# Altium schematic sheet Batarey.SchDoc
size A1; SheetNumber: 4; SheetTotal: 5
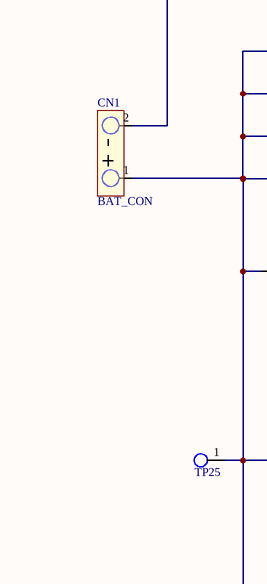
[diagram p0: Batarey.SchDoc, top left]
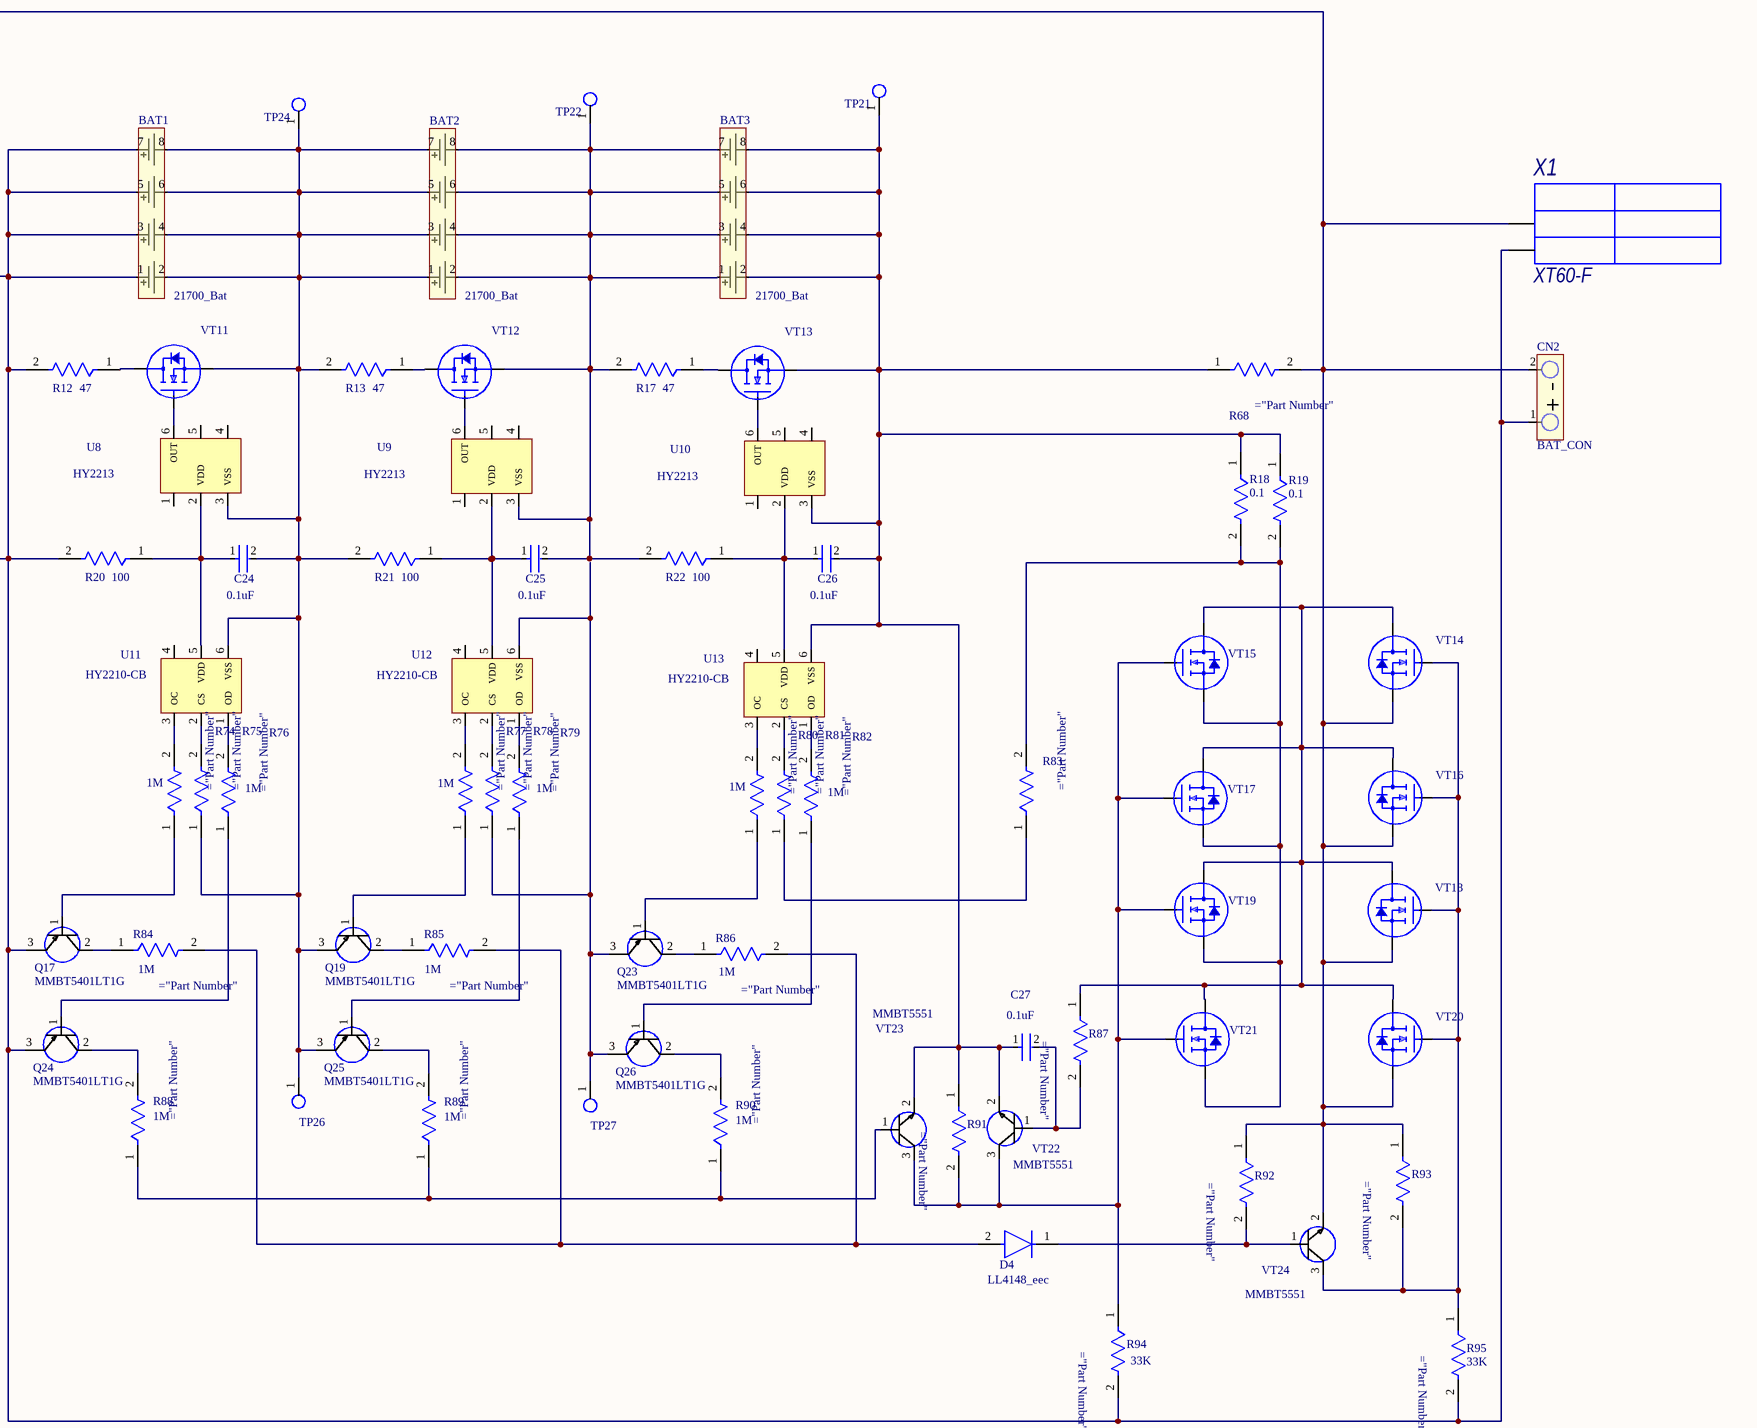
[diagram p1: Batarey.SchDoc, top right]
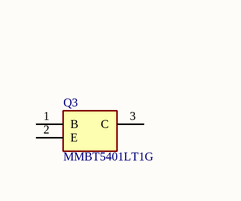
[diagram p2: Batarey.SchDoc, bottom left]

## Parts
BAT1  21700_Bat  [21700_BAT]
BAT2  21700_Bat  [21700_BAT]
BAT3  21700_Bat  [21700_BAT]
C24  0.1uF  [KEMET_C0805C-DN_IPC_A]
C25  0.1uF  [KEMET_C0805C-DN_IPC_A]
C26  0.1uF  [KEMET_C0805C-DN_IPC_A]
C27  0.1uF  [KEMET_C0805C-DN_IPC_A]
CN1  BAT_CON  [Batarey_connector]
CN2  BAT_CON  [Batarey_connector]
D4  LL4148_eec  [Fairchild-ON_Semiconductor_LL4148_0]
Q3  MMBT5401LT1G  [SOT96P237X111-3N]
Q17  MMBT5401LT1G  [SOT96P237X111-3N]
Q19  MMBT5401LT1G  [SOT96P237X111-3N]
Q23  MMBT5401LT1G  [SOT96P237X111-3N]
Q24  MMBT5401LT1G  [SOT96P237X111-3N]
Q25  MMBT5401LT1G  [SOT96P237X111-3N]
Q26  MMBT5401LT1G  [SOT96P237X111-3N]
R12  47  [TE_Connectivity_CRGCQ1210_IPC_A]
R13  47  [TE_Connectivity_CRGCQ1210_IPC_A]
R17  47  [TE_Connectivity_CRGCQ1210_IPC_A]
R18  0.1  [TE_Connectivity_CRGCQ1210_IPC_A]
R19  0.1  [TE_Connectivity_CRGCQ1210_IPC_A]
R20  100  [Vishay_CRCW0805-e3_IPC_A]
R21  100  [Vishay_CRCW0805-e3_IPC_A]
R22  100  [Vishay_CRCW0805-e3_IPC_A]
R68  RC0805FR-07100KL  [Vishay_CRCW0805-e3_IPC_A]  (value not drawn)
R74  1M  [Vishay_CRCW0805-e3_IPC_A]
R75  RC0805FR-07100KL  [Vishay_CRCW0805-e3_IPC_A]  (value not drawn)
R76  1M  [Vishay_CRCW0805-e3_IPC_A]
R77  1M  [Vishay_CRCW0805-e3_IPC_A]
R78  RC0805FR-07100KL  [Vishay_CRCW0805-e3_IPC_A]  (value not drawn)
R79  1M  [Vishay_CRCW0805-e3_IPC_A]
R80  1M  [Vishay_CRCW0805-e3_IPC_A]
R81  RC0805FR-07100KL  [Vishay_CRCW0805-e3_IPC_A]  (value not drawn)
R82  1M  [Vishay_CRCW0805-e3_IPC_A]
R83  RC0805FR-07100KL  [Vishay_CRCW0805-e3_IPC_A]  (value not drawn)
R84  1M  [Vishay_CRCW0805-e3_IPC_A]
R85  1M  [Vishay_CRCW0805-e3_IPC_A]
R86  1M  [Vishay_CRCW0805-e3_IPC_A]
R87  RC0805FR-07100KL  [Vishay_CRCW0805-e3_IPC_A]  (value not drawn)
R88  1M  [Vishay_CRCW0805-e3_IPC_A]
R89  1M  [Vishay_CRCW0805-e3_IPC_A]
R90  1M  [Vishay_CRCW0805-e3_IPC_A]
R91  RC0805FR-07100KL  [Vishay_CRCW0805-e3_IPC_A]  (value not drawn)
R92  RC0805FR-07100KL  [Vishay_CRCW0805-e3_IPC_A]  (value not drawn)
R93  RC0805FR-07100KL  [Vishay_CRCW0805-e3_IPC_A]  (value not drawn)
R94  33K  [Vishay_CRCW0805-e3_IPC_A]
R95  33K  [Vishay_CRCW0805-e3_IPC_A]
TP21  Test_Point_PCB  [TEST_POINT_CONN]  (value not drawn)
TP22  Test_Point_PCB  [TEST_POINT_CONN]  (value not drawn)
TP24  Test_Point_PCB  [TEST_POINT_CONN]  (value not drawn)
TP25  Test_Point_PCB  [TEST_POINT_CONN]  (value not drawn)
TP26  Test_Point_PCB  [TEST_POINT_CONN]  (value not drawn)
TP27  Test_Point_PCB  [TEST_POINT_CONN]  (value not drawn)
U8  HY2213  [HY2213]
U9  HY2213  [HY2213]
U10  HY2213  [HY2213]
U11  HY2210-CB  [HY2213]
U12  HY2210-CB  [HY2213]
U13  HY2210-CB  [HY2213]
VT11  IPB60R600P6  [TO-263-3]  (value not drawn)
VT12  IPB60R600P6  [TO-263-3]  (value not drawn)
VT13  IPB60R600P6  [TO-263-3]  (value not drawn)
VT14  IPB60R600P6  [TO-263-3]  (value not drawn)
VT15  IPB60R600P6  [TO-263-3]  (value not drawn)
VT16  IPB60R600P6  [TO-263-3]  (value not drawn)
VT17  IPB60R600P6  [TO-263-3]  (value not drawn)
VT18  IPB60R600P6  [TO-263-3]  (value not drawn)
VT19  IPB60R600P6  [TO-263-3]  (value not drawn)
VT20  IPB60R600P6  [TO-263-3]  (value not drawn)
VT21  IPB60R600P6  [TO-263-3]  (value not drawn)
VT22  MMBT5551  [BC847B215]
VT23  MMBT5551  [BC847B215]
VT24  MMBT5551  [BC847B215]
X1  XT60-F  [XT60-F AMASS]

## Nets
NetBAT1_1: BAT1.1(+1S) BAT1.3(+2S) BAT1.5(+3S) BAT1.7(+4S) CN1.1(+) CN2.1(+) Q17.3(E) Q24.3(E) R12.2 R20.2 R94.2 R95.2 TP25.1(G9) X1.2
NetBAT1_4: BAT1.4(-2S) BAT1.6(-3S) BAT2.1(+1S) BAT2.3(+2S) BAT2.5(+3S) BAT2.7(+4S) C24.2 Q19.3(E) Q25.3(E) R21.2 R75.1 TP26.1(G9) U8.3(VSS) U11.6(VSS) VT11.S
NetBAT1_8: BAT1.8(-4S) TP24.1(G9)
NetBAT2_2: BAT2.2(-1S) BAT2.4(-2S) BAT2.6(-3S) BAT2.8(-4S) BAT3.1(+1S) BAT3.3(+2S) BAT3.5(+3S) BAT3.7(+4S) C25.2 R17.2 R22.2 TP22.1(G9) U9.3(VSS) VT12.S
NetBAT3_2: BAT3.2(-1S) BAT3.4(-2S) BAT3.6(-3S) BAT3.8(-4S) C26.2 C27.1 R18.1 R19.1 R68.1 R91.1 TP21.1(G9) U10.3(VSS) U13.6(VSS) VT13.S VT22.2(E) VT23.2(E)
NetC24_1: C24.1 R20.1 U8.2(VDD) U11.5(VDD)
NetC25_1: C25.1 R21.1 U9.2(VDD) U12.5(VDD)
NetC26_1: C26.1 R22.1 U10.2(VDD) U13.5(VDD)
NetC27_2: C27.2 R87.2 VT22.1(B)
NetCN1_2: CN1.2(-) CN2.2(-) R68.2 R92.1 R93.1 VT14.S VT16.S VT18.S VT20.S VT24.2(E) X1.1
NetD4_1: D4.1(C) R92.2 VT24.1(B)
NetD4_2: D4.2(A) R84.2 R85.2 R86.2
NetQ17_1: Q17.1(B) R74.1
NetQ17_2: Q17.2(C) R84.1
NetQ19_1: Q19.1(B) R77.1
NetQ19_2: Q19.2(C) R85.1
NetQ23_1: Q23.1(B) R80.1
NetQ23_2: Q23.2(C) R86.1
NetQ23_3: Q23.3(E) Q26.3(E) R78.1 TP27.1(G9) U12.6(VSS)
NetQ24_1: Q24.1(B) R76.1
NetQ24_2: Q24.2(C) R88.2
NetQ25_1: Q25.1(B) R79.1
NetQ25_2: Q25.2(C) R89.2
NetQ26_1: Q26.1(B) R82.1
NetQ26_2: Q26.2(C) R90.2
NetR12_1: R12.1 VT11.D
NetR13_1: R13.1 VT12.D
NetR17_1: R17.1 VT13.D
NetR18_2: R18.2 R19.2 R83.2 VT15.S VT17.S VT19.S VT21.S
NetR74_2: R74.2 U11.3(OC)
NetR75_2: R75.2 U11.2(CS)
NetR76_2: R76.2 U11.1(OD)
NetR77_2: R77.2 U12.3(OC)
NetR78_2: R78.2 U12.2(CS)
NetR79_2: R79.2 U12.1(OD)
NetR80_2: R80.2 U13.3(OC)
NetR81_1: R81.1 R83.1
NetR81_2: R81.2 U13.2(CS)
NetR82_2: R82.2 U13.1(OD)
NetR87_1: R87.1 VT14.D VT15.D VT16.D VT17.D VT18.D VT19.D VT20.D VT21.D
NetR88_1: R88.1 R89.1 R90.1 VT23.1(B)
NetR91_2: R91.2 R94.1 VT15.G VT17.G VT19.G VT21.G VT22.3(C) VT23.3(C)
NetR93_2: R93.2 R95.1 VT14.G VT16.G VT18.G VT20.G VT24.3(C)
NetU8_6: U8.6(OUT) VT11.G
NetU9_6: U9.6(OUT) VT12.G
NetU10_6: U10.6(OUT) VT13.G

Not connected (* = marked no-connect by the designer): BAT1 2(-1S); Q3 1(B) 2(E) 3(C); R13 2; U8 1(47) 4 5; U9 1(47) 4 5; U10 1(47) 4 5; U11 4; U12 4; U13 4

## Library data of the parts
C24-C27 = C0805C224K5RACTU
CN1 CN2 = BAT_CON: Batarey_connection
D4 = Diode_Fairchild-ON_Semiconductor_LL4148_eec: DIODE GEN PURP 100V 200MA SOD80; Part Number: LL4148; Manufacturer: Fairchild/ON Semiconductor; Num Pins: 2; helpURL: https://upverter.com/upn/revision/7267ed481d20a817/; ComponentLink2Description: Datasheet; Temperature: -55°C to +175°C; Package: SOD80; Supplier 2: Mouser; Price: 0.0408687939508; Supplier 1: Digi-Key; ComponentLink1URL: https://upverter.com/upn/revision/7267ed481d20a817/; Supplier Part Number 2: 512-LL4148; Supplier Part Number 1: LL4148FSCT-ND; ComponentLink1Description: Upverter; ComponentLink2URL: https://www.fairchildsemi.com/datasheets/LL/LL4148.pdf; RoHS: TRUE; Mouser Part Number: 512-LL4148; Temperature Range High: +175°C; Digikey Description: DIODE GEN PURP 100V 200MA SOD80; Digikey Part Number: LL4148FSCT-ND; Lead Free: yes; Temperature Range Low: -55°C
Q3 = MMBT5401LT1G: Transistor; Manufacturer_Name: onsemi; Datasheet Link: http://www.onsemi.com/pub/Collateral/MMBT5401LT1-D.PDF; Height: 1.11mm; Manufacturer_Part_Number: MMBT5401LT1G; Mouser Part Number: 863-MMBT5401LT1G; Mouser Price/Stock: https://www.mouser.co.uk/ProductDetail/onsemi/MMBT5401LT1G?qs=R2UZ7gjkEjK19vIt05hkDw%3D%3D; Arrow Part Number: MMBT5401LT1G; Arrow Price/Stock: https://www.arrow.com/en/products/mmbt5401lt1g/on-semiconductor?region=nac
Q17 Q19 Q23-Q26 = MMBT5401LT1G: Transistor; pin to pad: 2>3 3>2; Manufacturer_Name: onsemi; Datasheet Link: http://www.onsemi.com/pub/Collateral/MMBT5401LT1-D.PDF; Height: 1.11mm; Manufacturer_Part_Number: MMBT5401LT1G; Mouser Part Number: 863-MMBT5401LT1G; Mouser Price/Stock: https://www.mouser.co.uk/ProductDetail/onsemi/MMBT5401LT1G?qs=R2UZ7gjkEjK19vIt05hkDw%3D%3D; Arrow Part Number: MMBT5401LT1G; Arrow Price/Stock: https://www.arrow.com/en/products/mmbt5401lt1g/on-semiconductor?region=nac
R12 R13 R17-R19 = CRCW08050000Z0EA: 100; 100k: *
R20-R22 = CRCW08050000Z0EA: 100k: *
R74 R76 R77 R79 R80 R82 R84-R86 R88-R90 R94 R95 = RC0805FR-07100KL
TP21 TP22 TP24-TP27 = TP_PCB?: Test_Point
VT11-VT21 = IPB60R600P6: Транзистор МОП, одиночный, N-канальный; pin to pad: D>2 G>1 S>3; ComponentDescription: =ComponentType+', '+ChannelType+', '+Comment+', '+Package; ChannelType: N-канальный; ComponentType: Транзистор МОП, одиночный; Package: TO-263-3
X1 = XT60-F: Разъем; ComponentDescription: Разъём, XT60-F; ComponentTypе: Разъём